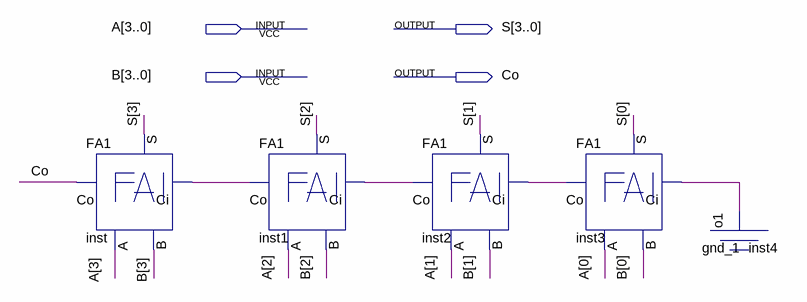
[diagram p0: schematic sheet]
// Quartus schematic FA4.bdf as structural Verilog: 5 symbols, 4 pins
module FA4 (
  input  [3:0] A,
  input  [3:0] B,
  output [3:0] S,
  output Co
);

  wire inst1_co, inst2_co, inst3_co, inst4_o1;

  FA1 inst (.Ci(inst1_co), .A(A[3]), .B(B[3]), .S(S[3]), .Co(Co));
  FA1 inst1 (.Ci(inst2_co), .A(A[2]), .B(B[2]), .S(S[2]), .Co(inst1_co));
  FA1 inst2 (.Ci(inst3_co), .A(A[1]), .B(B[1]), .S(S[1]), .Co(inst2_co));
  FA1 inst3 (.Ci(inst4_o1), .A(A[0]), .B(B[0]), .S(S[0]), .Co(inst3_co));
  gnd_1 inst4 (.o1(inst4_o1));
endmodule
